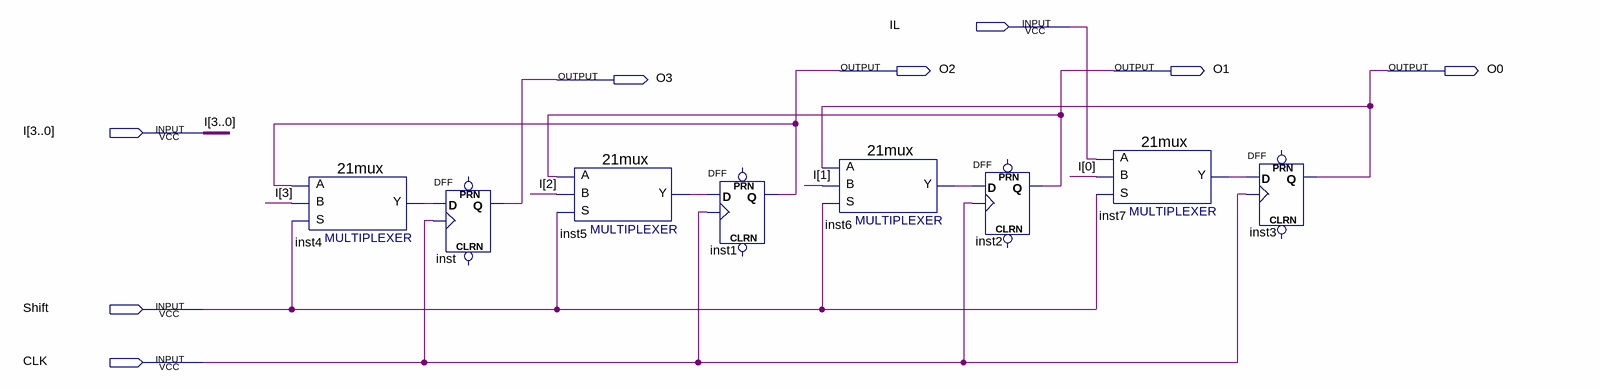
[diagram p0: schematic sheet]
// Quartus schematic Left.bdf as structural Verilog: 8 symbols, 8 pins
module Left (
  input  IL,
  input  [3:0] I,
  input  Shift,
  input  CLK,
  output O2,
  output O1,
  output O0,
  output O3
);

  wire inst4_y, inst5_y, inst6_y, inst7_y;

  \21mux  inst4 (.S(Shift), .B(I[3]), .A(O2), .Y(inst4_y));
  DFF inst (.CLK(CLK), .D(inst4_y), .Q(O3));  // open: CLRN, PRN
  \21mux  inst5 (.S(Shift), .B(I[2]), .A(O1), .Y(inst5_y));
  DFF inst1 (.CLK(CLK), .D(inst5_y), .Q(O2));  // open: CLRN, PRN
  \21mux  inst6 (.S(Shift), .B(I[1]), .A(O0), .Y(inst6_y));
  DFF inst2 (.CLK(CLK), .D(inst6_y), .Q(O1));  // open: CLRN, PRN
  \21mux  inst7 (.S(Shift), .B(I[0]), .A(IL), .Y(inst7_y));
  DFF inst3 (.CLK(CLK), .D(inst7_y), .Q(O0));  // open: CLRN, PRN
endmodule
